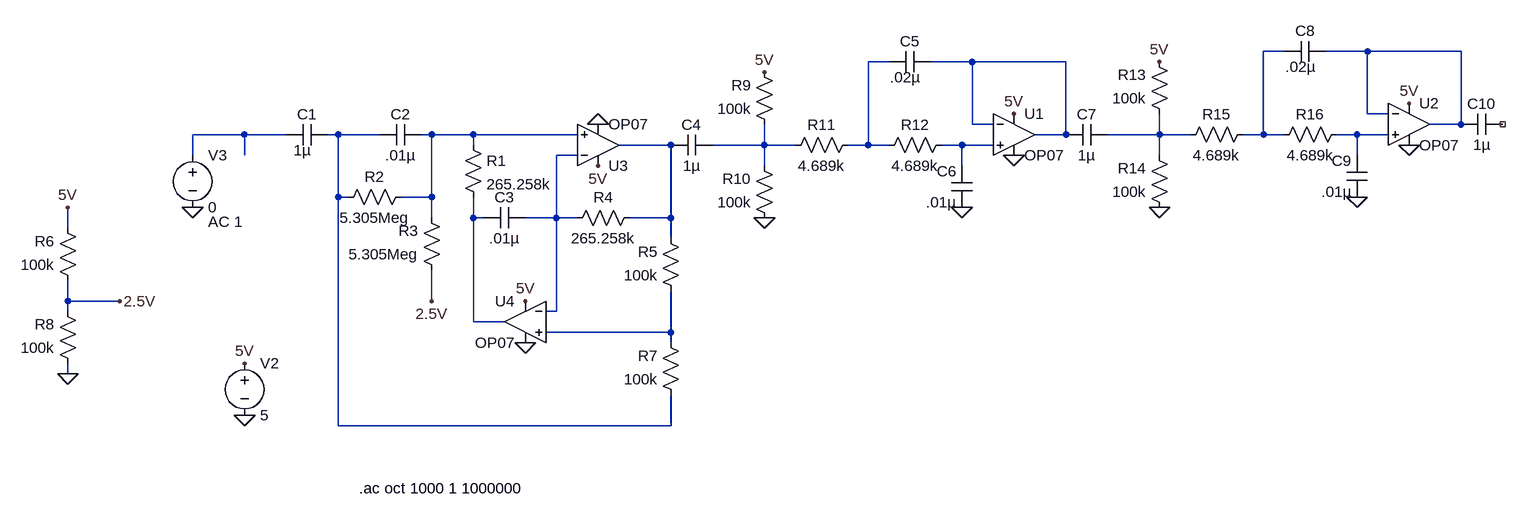
[diagram p0: schematic filters.asc]
filters.asc, the LTspice schematic file:
Version 4
SHEET 1 1768 752
WIRE 1424 64 1392 64
WIRE 1552 64 1488 64
WIRE 1696 64 1552 64
WIRE 816 80 784 80
WIRE 944 80 880 80
WIRE 1088 80 944 80
WIRE 1552 160 1552 64
WIRE 1584 160 1552 160
WIRE 944 176 944 80
WIRE 976 176 944 176
WIRE 1696 176 1696 64
WIRE 1696 176 1648 176
WIRE -176 192 -256 192
WIRE -112 192 -176 192
WIRE -32 192 -48 192
WIRE 32 192 -32 192
WIRE 112 192 96 192
WIRE 176 192 112 192
WIRE 336 192 176 192
WIRE 1088 192 1088 80
WIRE 1088 192 1040 192
WIRE 1232 192 1232 160
WIRE 1232 192 1152 192
WIRE 1280 192 1232 192
WIRE 1392 192 1392 64
WIRE 1392 192 1360 192
WIRE 1424 192 1392 192
WIRE 1536 192 1504 192
WIRE 1584 192 1536 192
WIRE 176 208 176 192
WIRE 480 208 400 208
WIRE 624 208 624 176
WIRE 624 208 544 208
WIRE 672 208 624 208
WIRE 784 208 784 80
WIRE 784 208 752 208
WIRE 816 208 784 208
WIRE 928 208 896 208
WIRE 976 208 928 208
WIRE -256 224 -256 192
WIRE -176 224 -176 192
WIRE 336 224 304 224
WIRE 1232 224 1232 192
WIRE 1536 224 1536 192
WIRE 624 240 624 208
WIRE 928 240 928 208
WIRE -32 288 -32 192
WIRE -16 288 -32 288
WIRE 112 288 112 192
WIRE 112 288 64 288
WIRE 112 320 112 288
WIRE 176 320 176 288
WIRE 192 320 176 320
WIRE 304 320 304 224
WIRE 304 320 256 320
WIRE 336 320 304 320
WIRE 480 320 480 208
WIRE 480 320 416 320
WIRE -448 336 -448 304
WIRE 480 352 480 320
WIRE -448 448 -448 416
WIRE -368 448 -448 448
WIRE 112 448 112 400
WIRE -448 464 -448 448
WIRE 304 464 304 320
WIRE 304 464 288 464
WIRE 176 480 176 320
WIRE 224 480 176 480
WIRE 480 496 480 432
WIRE 480 496 288 496
WIRE 480 512 480 496
WIRE -448 560 -448 544
WIRE -32 640 -32 288
WIRE 480 640 480 592
WIRE 480 640 -32 640
FLAG -176 544 5V
FLAG 256 448 5V
FLAG 368 240 5V
FLAG 256 512 0
FLAG 368 176 0
FLAG -256 304 0
FLAG -176 624 0
FLAG -448 560 0
FLAG 112 448 2.5V
FLAG -368 448 2.5V
FLAG -448 304 5V
FLAG 1008 160 5V
FLAG 1008 224 0
FLAG 624 320 0
FLAG 624 96 5V
FLAG 928 304 0
FLAG 1616 144 5V
FLAG 1616 208 0
FLAG 1232 304 0
FLAG 1232 80 5V
FLAG 1536 288 0
SYMBOL cap -48 176 R90
WINDOW 0 0 32 VBottom 2
WINDOW 3 24 39 VTop 2
SYMATTR InstName C1
SYMATTR Value 1µ
SYMBOL cap 96 176 R90
WINDOW 0 0 32 VBottom 2
WINDOW 3 32 32 VTop 2
SYMATTR InstName C2
SYMATTR Value .01µ
SYMBOL cap 256 304 R90
WINDOW 0 0 32 VBottom 2
WINDOW 3 32 32 VTop 2
SYMATTR InstName C3
SYMATTR Value .01µ
SYMBOL cap 544 192 R90
WINDOW 0 0 32 VBottom 2
WINDOW 3 32 32 VTop 2
SYMATTR InstName C4
SYMATTR Value 1µ
SYMBOL res 160 192 R0
SYMATTR InstName R1
SYMATTR Value 265.258k
SYMBOL res 80 272 R90
WINDOW 0 0 56 VBottom 2
WINDOW 3 32 56 VTop 2
SYMATTR InstName R2
SYMATTR Value 5.305Meg
SYMBOL res 128 416 R180
WINDOW 0 36 76 Left 2
WINDOW 3 36 40 Left 2
SYMATTR InstName R3
SYMATTR Value 5.305Meg
SYMBOL res 432 304 R90
WINDOW 0 0 56 VBottom 2
WINDOW 3 32 56 VTop 2
SYMATTR InstName R4
SYMATTR Value 265.258k
SYMBOL res 496 448 R180
WINDOW 0 36 76 Left 2
WINDOW 3 36 40 Left 2
SYMATTR InstName R5
SYMATTR Value 100k
SYMBOL res 496 608 R180
WINDOW 0 36 76 Left 2
WINDOW 3 36 40 Left 2
SYMATTR InstName R7
SYMATTR Value 100k
SYMBOL voltage -176 528 R0
SYMATTR InstName V2
SYMATTR Value 5
SYMBOL res -432 432 R180
WINDOW 0 36 76 Left 2
WINDOW 3 36 40 Left 2
SYMATTR InstName R6
SYMATTR Value 100k
SYMBOL res -432 560 R180
WINDOW 0 36 76 Left 2
WINDOW 3 36 40 Left 2
SYMATTR InstName R8
SYMATTR Value 100k
SYMBOL OP07 368 272 M180
SYMATTR InstName U3
SYMBOL OP07 256 416 M0
SYMATTR InstName U4
SYMBOL res 640 192 R180
WINDOW 0 36 76 Left 2
WINDOW 3 36 40 Left 2
SYMATTR InstName R9
SYMATTR Value 100k
SYMBOL res 640 336 R180
WINDOW 0 36 76 Left 2
WINDOW 3 36 40 Left 2
SYMATTR InstName R10
SYMATTR Value 100k
SYMBOL res 656 224 R270
WINDOW 0 32 56 VTop 2
WINDOW 3 0 56 VBottom 2
SYMATTR InstName R11
SYMATTR Value 4.689k
SYMBOL res 800 224 R270
WINDOW 0 32 56 VTop 2
WINDOW 3 0 56 VBottom 2
SYMATTR InstName R12
SYMATTR Value 4.689k
SYMBOL cap 880 64 R90
WINDOW 0 0 32 VBottom 2
WINDOW 3 24 39 VTop 2
SYMATTR InstName C5
SYMATTR Value .02µ
SYMBOL cap 944 304 R180
WINDOW 0 24 56 Left 2
WINDOW 3 24 8 Left 2
SYMATTR InstName C6
SYMATTR Value .01µ
SYMBOL OP07 1008 128 R0
SYMATTR InstName U1
SYMBOL cap 1152 176 R90
WINDOW 0 0 32 VBottom 2
WINDOW 3 32 32 VTop 2
SYMATTR InstName C7
SYMATTR Value 1µ
SYMBOL res 1248 176 R180
WINDOW 0 36 76 Left 2
WINDOW 3 36 40 Left 2
SYMATTR InstName R13
SYMATTR Value 100k
SYMBOL res 1248 320 R180
WINDOW 0 36 76 Left 2
WINDOW 3 36 40 Left 2
SYMATTR InstName R14
SYMATTR Value 100k
SYMBOL res 1264 208 R270
WINDOW 0 32 56 VTop 2
WINDOW 3 0 56 VBottom 2
SYMATTR InstName R15
SYMATTR Value 4.689k
SYMBOL res 1408 208 R270
WINDOW 0 32 56 VTop 2
WINDOW 3 0 56 VBottom 2
SYMATTR InstName R16
SYMATTR Value 4.689k
SYMBOL cap 1488 48 R90
WINDOW 0 0 32 VBottom 2
WINDOW 3 24 39 VTop 2
SYMATTR InstName C8
SYMATTR Value .02µ
SYMBOL cap 1552 288 R180
WINDOW 0 24 56 Left 2
WINDOW 3 24 8 Left 2
SYMATTR InstName C9
SYMATTR Value .01µ
SYMBOL OP07 1616 112 R0
SYMATTR InstName U2
SYMBOL cap 1760 160 R90
WINDOW 0 0 32 VBottom 2
WINDOW 3 32 32 VTop 2
SYMATTR InstName C10
SYMATTR Value 1µ
SYMBOL voltage -256 208 R0
WINDOW 123 24 118 Left 2
SYMATTR Value2 AC 1
SYMATTR InstName V3
SYMATTR Value 0
TEXT 0 736 Left 2 !.ac oct 1000 1 1000000

The netlist it stands for:
* filters.asc
C1 N006 N005 1µ
C2 N007 N006 .01µ
C3 N013 N014 .01µ
C4 N011 N010 1µ
R1 N007 N014 265.258k
R2 N007 N006 5.305Meg
R3 2.5V N007 5.305Meg
R4 N010 N013 265.258k
R5 N015 N010 100k
R7 N006 N015 100k
V2 5V 0 5
R6 2.5V 5V 100k
R8 0 2.5V 100k
XU3 N007 N013 5V 0 N010 LT1001  ; OP07, pins In+ In- V+ V- OUT
XU4 N015 N013 5V 0 N014 LT1001  ; OP07, pins In+ In- V+ V- OUT
R9 N011 5V 100k
R10 0 N011 100k
R11 N011 N003 4.689k
R12 N003 N012 4.689k
C5 N004 N003 .02µ
C6 0 N012 .01µ
XU1 N012 N004 5V 0 N004 LT1001  ; OP07, pins In+ In- V+ V- OUT
C7 N008 N004 1µ
R13 N008 5V 100k
R14 0 N008 100k
R15 N008 N001 4.689k
R16 N001 N009 4.689k
C8 N002 N001 .02µ
C9 0 N009 .01µ
XU2 N009 N002 5V 0 N002 LT1001  ; OP07, pins In+ In- V+ V- OUT
C10 NC_01 N002 1µ
V3 N005 0 0 AC 1
.ac oct 1000 1 1000000
.lib LTC.lib
.backanno
.end